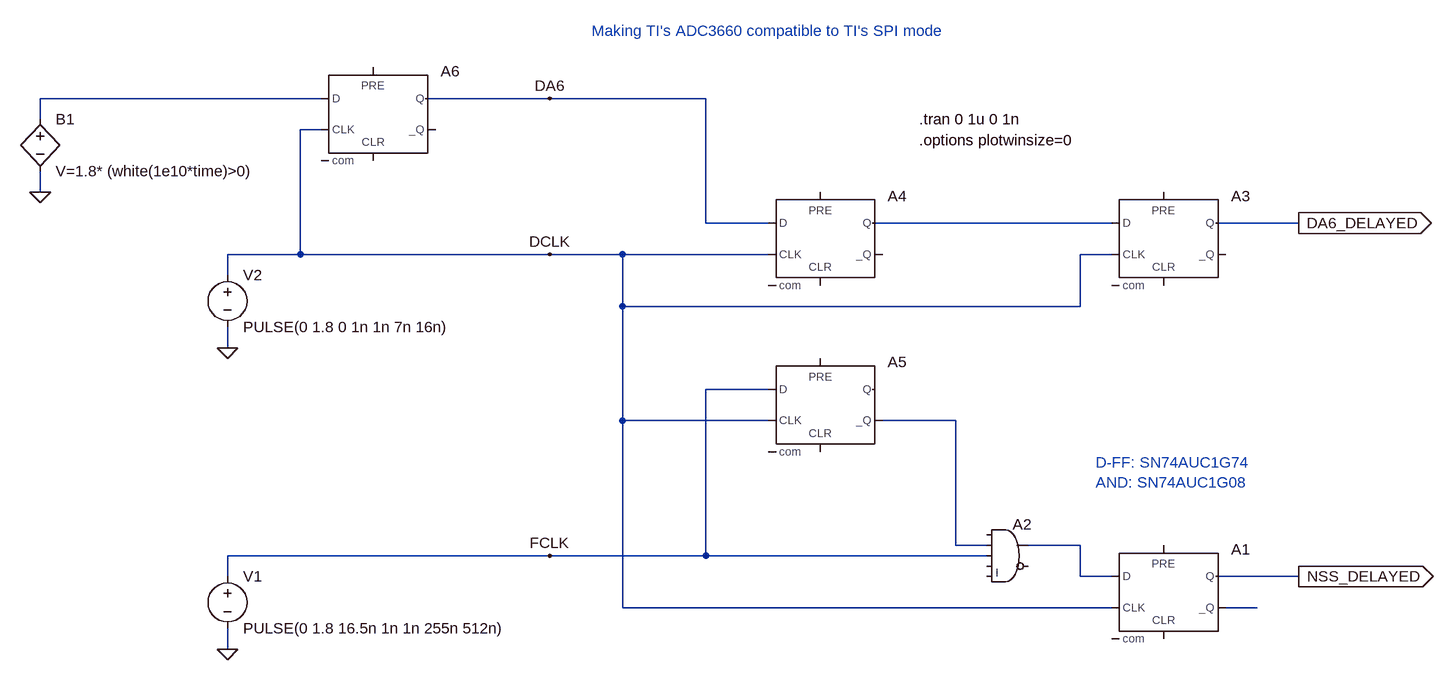
[diagram p0: schematic TISPI.asc]
TISPI.asc, the LTspice schematic file:
Version 4
SHEET 1 1440 680
WIRE -304 -480 -736 -480
WIRE 48 -480 -144 -480
WIRE 288 -480 48 -480
WIRE -736 -448 -736 -480
WIRE -304 -432 -336 -432
WIRE -736 -336 -736 -368
WIRE 288 -288 288 -480
WIRE 384 -288 288 -288
WIRE 912 -288 544 -288
WIRE 1200 -288 1072 -288
WIRE -336 -240 -336 -432
WIRE -336 -240 -448 -240
WIRE 48 -240 -336 -240
WIRE 160 -240 48 -240
WIRE 384 -240 160 -240
WIRE 912 -240 864 -240
WIRE -448 -208 -448 -240
WIRE 160 -160 160 -240
WIRE 864 -160 864 -240
WIRE 864 -160 160 -160
WIRE -448 -96 -448 -128
WIRE 384 -32 288 -32
WIRE 160 16 160 -160
WIRE 384 16 160 16
WIRE 672 16 560 16
WIRE 672 208 672 16
WIRE 720 208 672 208
WIRE 864 208 784 208
WIRE 48 224 -448 224
WIRE 288 224 288 -32
WIRE 288 224 48 224
WIRE 720 224 288 224
WIRE -448 256 -448 224
WIRE 864 256 864 208
WIRE 912 256 864 256
WIRE 1200 256 1072 256
WIRE 160 304 160 16
WIRE 912 304 160 304
WIRE 1136 304 1088 304
WIRE -448 368 -448 336
FLAG 1200 256 NSS_DELAYED
IOPIN 1200 256 Out
FLAG -448 368 0
FLAG 48 224 FCLK
FLAG -448 -96 0
FLAG 48 -240 DCLK
FLAG -736 -336 0
FLAG 48 -480 DA6
FLAG 1200 -288 DA6_DELAYED
IOPIN 1200 -288 Out
SYMBOL Digital\\dflop 992 208 R0
WINDOW 3 186 86 Invisible 0
SYMATTR Value Ref=0.9
SYMATTR Value2 Vhigh=1.8  Vlow=0
SYMATTR SpiceLine Td=1.5n   Trise=1n Tfall=1n
SYMATTR InstName A1
SYMBOL voltage -448 240 R0
WINDOW 123 0 0 Left 0
WINDOW 39 0 0 Left 0
SYMATTR InstName V1
SYMATTR Value PULSE(0 1.8 16.5n 1n 1n 255n 512n)
SYMBOL voltage -448 -224 R0
WINDOW 123 0 0 Left 0
WINDOW 39 0 0 Left 0
SYMATTR InstName V2
SYMATTR Value PULSE(0 1.8 0 1n 1n 7n 16n)
SYMBOL Digital\\and 752 160 R0
WINDOW 3 -97 118 Invisible 2
SYMATTR Value Vhigh=1.8 Vlow=0
SYMATTR InstName A2
SYMATTR Value2 Td=1.5n Trise=1n Tfall=1n
SYMBOL Digital\\dflop 464 -336 R0
WINDOW 3 186 86 Invisible 0
SYMATTR Value Ref=0.9
SYMATTR Value2 Vhigh=1.8  Vlow=0
SYMATTR SpiceLine Td=1.5n   Trise=1n Tfall=1n
SYMATTR InstName A4
SYMBOL Digital\\dflop 464 -80 R0
WINDOW 3 186 86 Invisible 0
SYMATTR Value Ref=0.9
SYMATTR Value2 Vhigh=1.8  Vlow=0
SYMATTR SpiceLine Td=1.5n   Trise=1n Tfall=1n
SYMATTR InstName A5
SYMBOL bv -736 -464 R0
SYMATTR InstName B1
SYMATTR Value V=1.8* (white(1e10*time)>0)
SYMBOL Digital\\dflop 992 -336 R0
WINDOW 3 186 86 Invisible 0
SYMATTR Value Ref=0.9
SYMATTR Value2 Vhigh=1.8  Vlow=0
SYMATTR SpiceLine Td=1.5n   Trise=1n Tfall=1n
SYMATTR InstName A3
SYMBOL Digital\\dflop -224 -528 R0
WINDOW 3 186 86 Invisible 0
SYMATTR Value Ref=0.9
SYMATTR Value2 Vhigh=1.8  Vlow=0
SYMATTR SpiceLine Td=1.5n   Trise=1n Tfall=1n
SYMATTR InstName A6
TEXT 616 -448 Left 2 !.tran 0 1u 0 1n
TEXT 616 -416 Left 2 !.options plotwinsize=0
TEXT 888 80 Left 2 ;D-FF: SN74AUC1G74\nAND: SN74AUC1G08
TEXT 112 -584 Left 2 ;Making TI's ADC3660 compatible to TI's SPI mode

The netlist it stands for:
* TISPI.asc
A1 N004 0 DCLK 0 0 N005 NSS_DELAYED 0 DFLOP Ref=0.9 Vhigh=1.8  Vlow=0 Td=1.5n   Trise=1n Tfall=1n
V1 FCLK 0 PULSE(0 1.8 16.5n 1n 1n 255n 512n)
V2 DCLK 0 PULSE(0 1.8 0 1n 1n 7n 16n)
A2 0 N003 FCLK 0 0 0 N004 0 AND Vhigh=1.8 Vlow=0 Td=1.5n Trise=1n Tfall=1n
A4 DA6 0 DCLK 0 0 0 N002 0 DFLOP Ref=0.9 Vhigh=1.8  Vlow=0 Td=1.5n   Trise=1n Tfall=1n
A5 FCLK 0 DCLK 0 0 N003 0 0 DFLOP Ref=0.9 Vhigh=1.8  Vlow=0 Td=1.5n   Trise=1n Tfall=1n
B1 N001 0 V=1.8* (white(1e10*time)>0)
A3 N002 0 DCLK 0 0 0 DA6_DELAYED 0 DFLOP Ref=0.9 Vhigh=1.8  Vlow=0 Td=1.5n   Trise=1n Tfall=1n
A6 N001 0 DCLK 0 0 0 DA6 0 DFLOP Ref=0.9 Vhigh=1.8  Vlow=0 Td=1.5n   Trise=1n Tfall=1n
.tran 0 1u 0 1n
.options plotwinsize=0
* D-FF: SN74AUC1G74
* AND: SN74AUC1G08
* Making TI's ADC3660 compatible to TI's SPI mode
.backanno
.end